# Altium schematic sheet Server Buttons.schdoc
size 471 x 267 mm
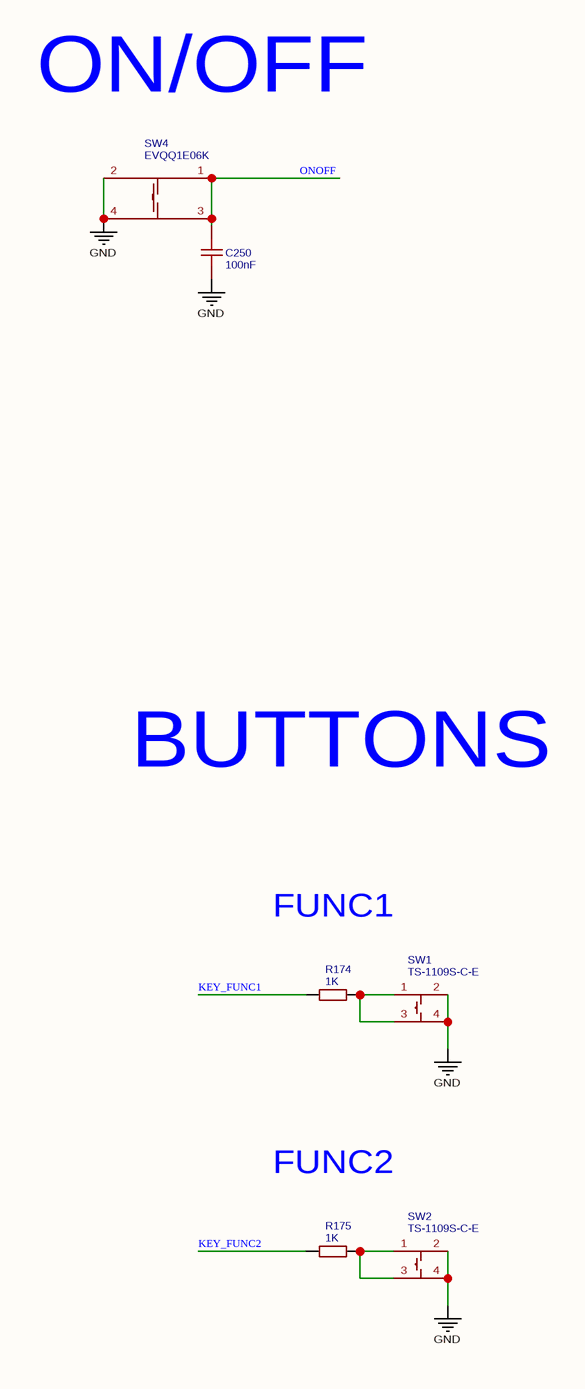
[diagram p0: Server Buttons.schdoc, left]
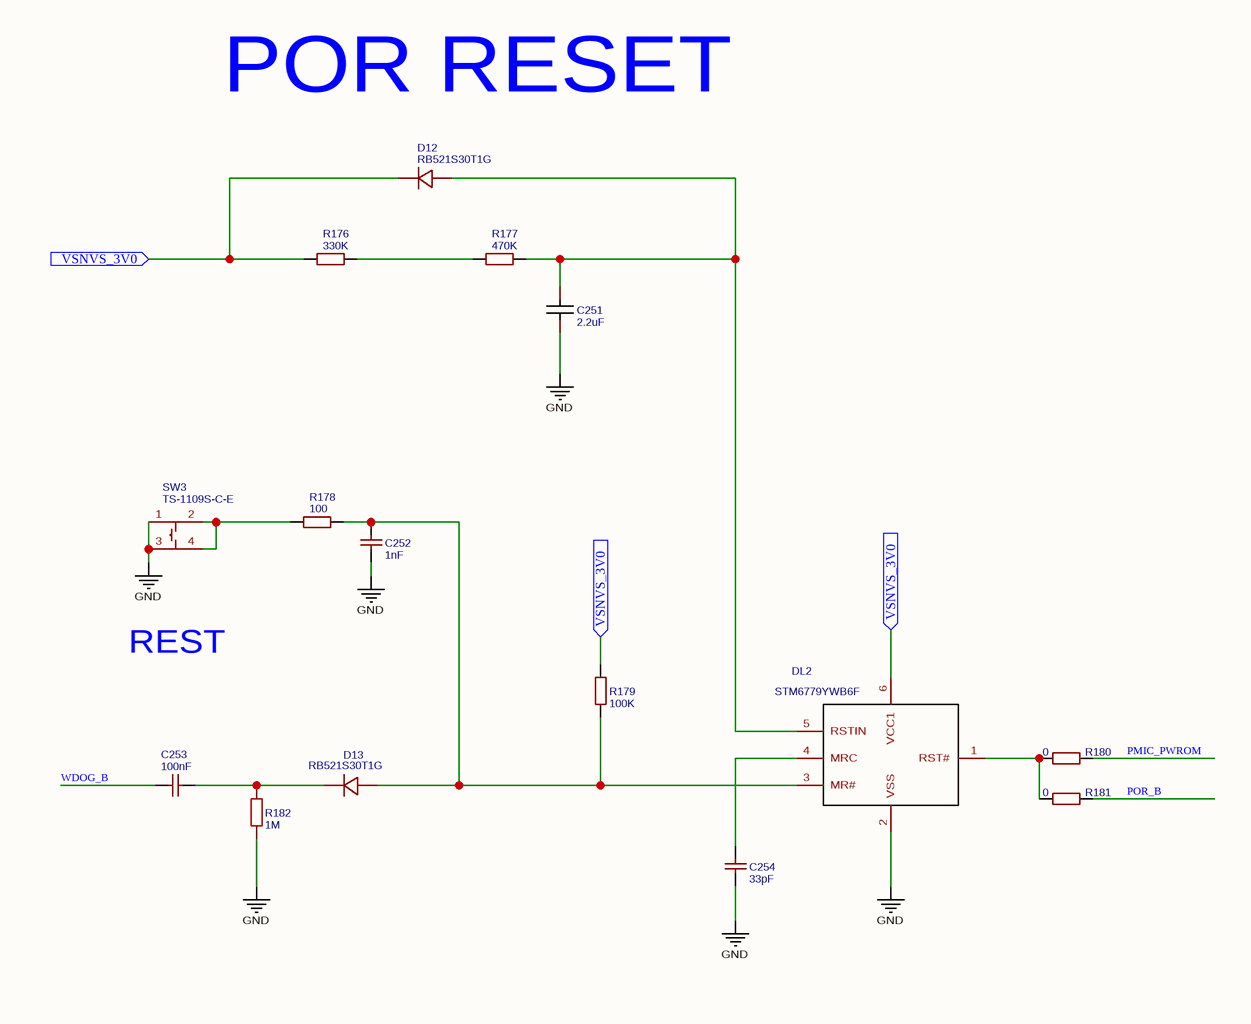
[diagram p1: Server Buttons.schdoc, right]

## Parts
C250  100nF  [C0603]
C251  2.2uF  [C0402]
C252  1nF  [C0805]
C253  100nF  [C0402]
C254  33pF  [C0402]
D12  RB521S30T1G  [SOD-523_L1.2-W0.8-LS1.6-RD]
D13  RB521S30T1G  [SOD-523_L1.2-W0.8-LS1.6-RD]
DL2  STM6779YWB6F  [SOT95P280X145-6N]
R174  1K  [R0402]
R175  1K  [R0402]
R176  330K  [R0402]
R177  470K  [R0402]
R178  100  [R0402]
R179  100K  [R0402]
R180  0  [R0402]
R181  0  [R0402]
R182  1M  [R0603]
SW1  TS-1109S-C-E  [SW-SMD_4P-L4.5-W4.5-P3.00-LS7.0]
SW2  TS-1109S-C-E  [SW-SMD_4P-L4.5-W4.5-P3.00-LS7.0]
SW3  TS-1109S-C-E  [SW-SMD_4P-L4.5-W4.5-P3.00-LS7.0]
SW4  EVQQ1E06K  [SW-SMD_4P-L10.0-W8.6-P4.50-LS10.0]

## Ports
VSNVS_3V0 (in)

## Nets
GND: C250.1 C251.1 C252.1 C254.1 DL2.2(VSS) R182.1 SW1.2 SW1.4 SW2.2 SW2.4 SW3.1 SW3.3 SW4.2 SW4.4
KEY_FUNC1: R174.1
KEY_FUNC2: R175.1
ONOFF: C250.2 SW4.1 SW4.3
PMIC_PWROM: R180.2
POR_B: R181.2
VSNVS_3V0: D12.1(C) DL2.6(VCC1) R176.1 R179.2 ; port VSNVS_3V0
WDOG_B: C253.2
NetC251_2: C251.2 D12.2(A) DL2.5(RSTIN) R177.2
NetC252_2: C252.2 D13.2(A) DL2.3(MR#) R178.2 R179.1
NetC253_1: C253.1 D13.1(C) R182.2
NetC254_2: C254.2 DL2.4(MRC)
NetDL2_1: DL2.1(RST#) R180.1 R181.1
NetR174_2: R174.2 SW1.1 SW1.3
NetR175_2: R175.2 SW2.1 SW2.3
NetR176_2: R176.2 R177.1
NetR178_1: R178.1 SW3.2 SW3.4

## Notes on the sheet
- ON/OFF
- POR RESET
- BUTTONS
- FUNC1
- REST
- FUNC2

## Library data of the parts
C250 = 100nF: BOM_Manufacturer: YAGEO; BOM_Manufacturer Part: CC0603KRX7R9BB104; nameAlias: Capacitance; SMT Type: Basic; BOM_Supplier: LCSC; BOM_LCSC Assembly: Yes; BOM_Supplier Part: C14663; spicePre: C; spiceSymbolName: CC0603KRX7R9BB104
C251 = 2.2uF: BOM_Manufacturer Part: CL05A225MQ5NSNC; BOM_Manufacturer: SAMSUNG; nameAlias: Capacitance; SMT Type: Extend; BOM_Supplier: LCSC; BOM_Supplier Part: C12530; BOM_LCSC Assembly: Yes; spicePre: C; spiceSymbolName: CL05A225MQ5NSNC
C252 = 1nF: BOM_Manufacturer Part: CL21B102KBCNNNC; BOM_Manufacturer: SAMSUNG; nameAlias: Capacitance; SMT Type: Basic; BOM_Supplier: LCSC; BOM_LCSC Assembly: Yes; BOM_Supplier Part: C46653; spicePre: C; spiceSymbolName: CL21B102KBCNNNC
C253 = 100nF: BOM_Manufacturer Part: CL05B104KO5NNNC; BOM_Manufacturer: SAMSUNG; nameAlias: Capacitance; SMT Type: Basic; BOM_Supplier: LCSC; BOM_LCSC Assembly: Yes; BOM_Supplier Part: C1525; spicePre: C; spiceSymbolName: CL05B104KO5NNNC
C254 = 33pF: BOM_Manufacturer: FH; BOM_Manufacturer Part: 0402CG330J500NT; nameAlias: Capacitance; SMT Type: Basic; BOM_Supplier: LCSC; BOM_LCSC Assembly: Yes; BOM_Supplier Part: C1562; spicePre: C; spiceSymbolName: 0402CG330J500NT
D12 D13 = RB521S30T1G: BOM_Manufacturer: ON Semicon; Contributor: LCSC; SMT Type: Extend; BOM_Supplier: LCSC; BOM_Supplier Part: C145179; BOM_Manufacturer Part: RB521S30T1G; BOM_LCSC Assembly: Yes; spicePre: D; spiceSymbolName: RB521S30T1G
DL2 = STM6779YWB6F: Contributor: Ke'Ondrae_Mell; spicePre: D; spiceSymbolName: STM6779YWB6F
R174 R175 = 1K: BOM_Manufacturer: UniOhm; BOM_Manufacturer Part: 0402WGF1001TCE; nameAlias: Resistance (Ohms); SMT Type: Basic; BOM_Supplier: LCSC; BOM_LCSC Assembly: Yes; BOM_Supplier Part: C11702; spicePre: R; spiceSymbolName: 0402WGF1001TCE
R176 = 330K: BOM_Manufacturer: UniOhm; BOM_Manufacturer Part: 0402WGF3303TCE; nameAlias: Resistance (Ohms); SMT Type: Basic; BOM_Supplier: LCSC; BOM_LCSC Assembly: Yes; BOM_Supplier Part: C25778; spicePre: R; spiceSymbolName: 0402WGF3303TCE
R177 = 470K: BOM_Manufacturer: UniOhm; BOM_Manufacturer Part: 0402WGF4703TCE; nameAlias: Resistance (Ohms); SMT Type: Basic; BOM_Supplier: LCSC; BOM_LCSC Assembly: Yes; BOM_Supplier Part: C25790; spicePre: R; spiceSymbolName: 0402WGF4703TCE
R178 = 100: BOM_Manufacturer: UniOhm; BOM_Manufacturer Part: 0402WGF1000TCE; nameAlias: Resistance (Ohms); SMT Type: Basic; BOM_Supplier: LCSC; BOM_LCSC Assembly: Yes; BOM_Supplier Part: C25076; spicePre: R; spiceSymbolName: 0402WGF1000TCE
R179 = 100K: BOM_Manufacturer: UniOhm; BOM_Manufacturer Part: 0402WGF1003TCE; nameAlias: Resistance (Ohms); SMT Type: Basic; BOM_Supplier: LCSC; BOM_LCSC Assembly: Yes; BOM_Supplier Part: C25741; spicePre: R; spiceSymbolName: 0402WGF1003TCE
R180 R181 = 0: BOM_Manufacturer: KOA; BOM_Manufacturer Part: RK73Z1ETTP; nameAlias: Resistance (Ohms); BOM_Supplier: LCSC; BOM_Supplier Part: C131359; spicePre: R; spiceSymbolName: RK73Z1ETTP
R182 = 1M: BOM_Manufacturer: Tyohm; BOM_Manufacturer Part: RMC06031M1%N; nameAlias: Resistance (Ohms); Contributor: LCSC; BOM_Supplier: LCSC; BOM_Supplier Part: C269705; spicePre: R; spiceSymbolName: RMC06031M1%N
SW1-SW3 = TS-1109S-C-E: BOM_Manufacturer: XKB Enterprise; Contributor: LCSC; BOM_Supplier: LCSC; BOM_Supplier Part: C561507; BOM_Manufacturer Part: TS-1109S-C-E; spicePre: S; spiceSymbolName: TS-1109S-C-E
SW4 = EVQQ1E06K: BOM_Manufacturer: PANASONIC; Contributor: LCSC; BOM_Supplier: LCSC; BOM_Manufacturer Part: EVQQ1E06K; BOM_Supplier Part: C79177; spicePre: S; spiceSymbolName: EVQQ1E06K